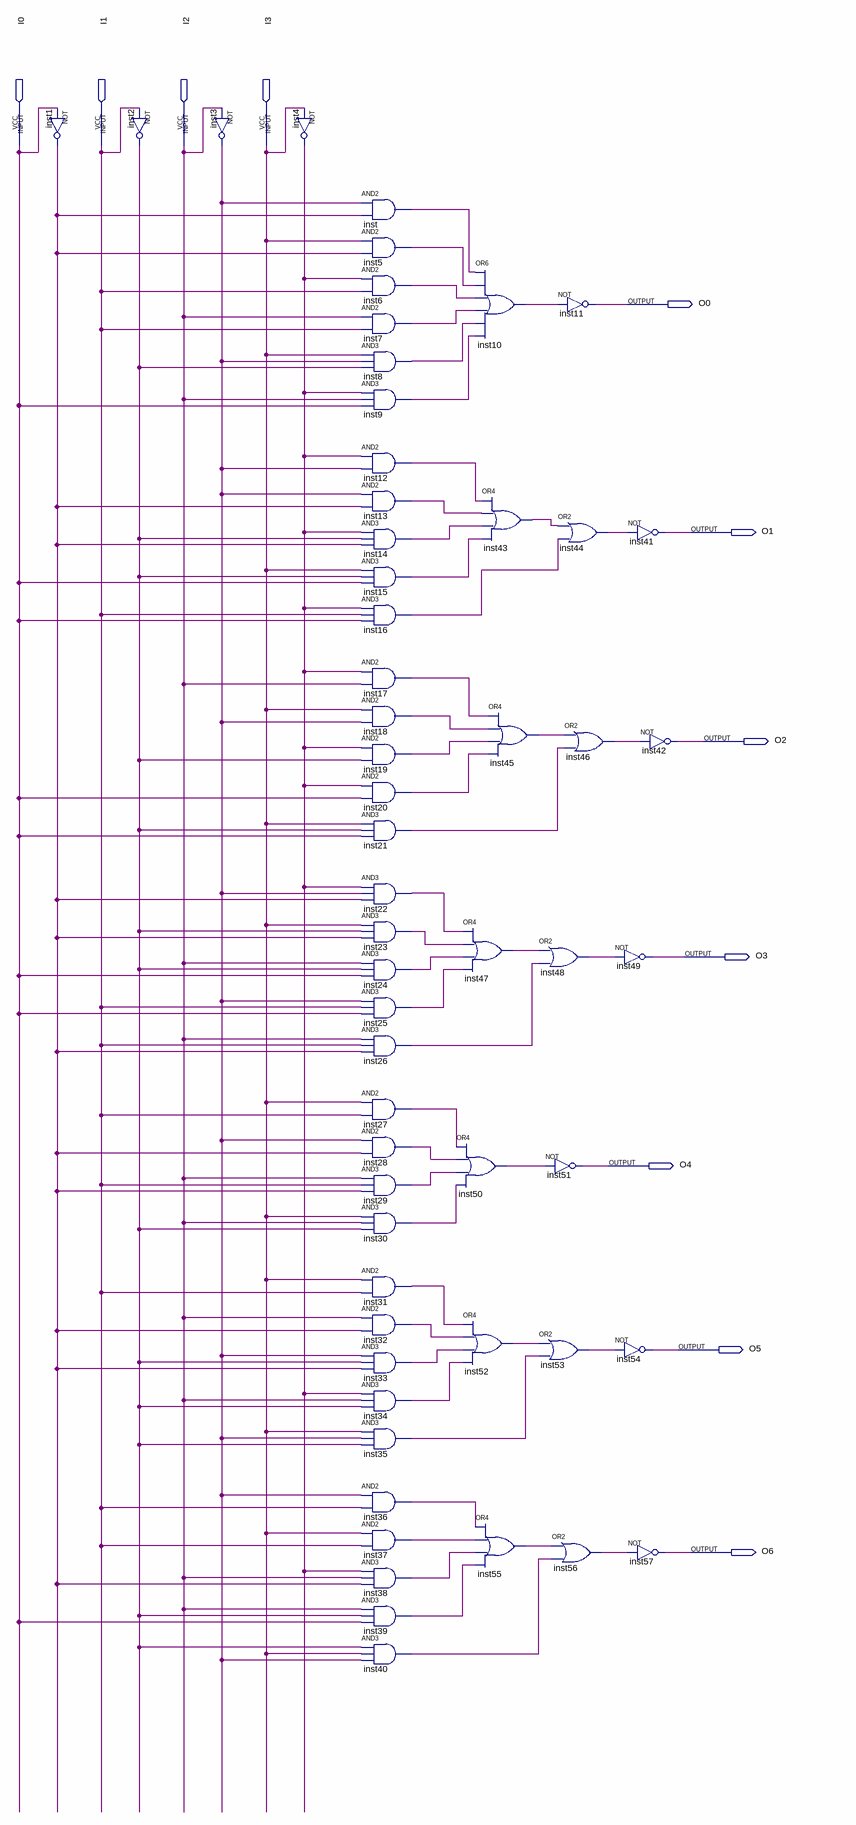
[diagram p0: schematic sheet]
// Quartus schematic lab_02.bdf as structural Verilog: 58 symbols, 11 pins
module lab_02 (
  input  I0,
  input  I1,
  input  I2,
  input  I3,
  output O0,
  output O1,
  output O2,
  output O3,
  output O4,
  output O5,
  output O6
);

  wire inst1_out, inst2_out, inst3_out, inst4_out, inst5_out, inst6_out, inst7_out, inst8_out, inst9_out,
       inst10_out, inst12_out, inst13_out, inst14_out, inst15_out, inst16_out, inst17_out, inst18_out,
       inst19_out, inst20_out, inst21_out, inst22_out, inst23_out, inst24_out, inst25_out, inst26_out,
       inst27_out, inst28_out, inst29_out, inst30_out, inst31_out, inst32_out, inst33_out, inst34_out,
       inst35_out, inst36_out, inst37_out, inst38_out, inst39_out, inst40_out, inst43_out, inst44_out,
       inst45_out, inst46_out, inst47_out, inst48_out, inst50_out, inst52_out, inst53_out, inst55_out,
       inst56_out, inst_out;

  not inst1 (inst1_out, I0);
  not inst2 (inst2_out, I1);
  not inst3 (inst3_out, I2);
  not inst4 (inst4_out, I3);
  and inst (inst_out, inst3_out, inst1_out);
  and inst5 (inst5_out, I3, inst1_out);
  and inst6 (inst6_out, inst4_out, I1);
  and inst7 (inst7_out, I2, I1);
  and inst8 (inst8_out, I3, inst3_out, inst2_out);
  and inst9 (inst9_out, inst4_out, I2, I0);
  and inst12 (inst12_out, inst4_out, inst3_out);
  and inst13 (inst13_out, inst3_out, inst1_out);
  and inst14 (inst14_out, inst4_out, inst2_out, inst1_out);
  and inst15 (inst15_out, I3, inst2_out, I0);
  and inst16 (inst16_out, inst4_out, I1, I0);
  and inst17 (inst17_out, inst4_out, I2);
  and inst18 (inst18_out, I3, inst3_out);
  and inst19 (inst19_out, inst4_out, inst2_out);
  and inst20 (inst20_out, inst4_out, I0);
  and inst21 (inst21_out, I3, inst2_out, I0);
  and inst22 (inst22_out, inst4_out, inst3_out, inst1_out);
  and inst23 (inst23_out, I3, inst2_out, inst1_out);
  and inst24 (inst24_out, I2, inst2_out, I0);
  and inst25 (inst25_out, inst3_out, I1, I0);
  and inst26 (inst26_out, I2, I1, inst1_out);
  and inst27 (inst27_out, I3, I1);
  and inst28 (inst28_out, inst3_out, inst1_out);
  and inst29 (inst29_out, I2, I1, inst1_out);
  and inst30 (inst30_out, I3, I2, inst2_out);
  and inst31 (inst31_out, I3, I1);
  and inst32 (inst32_out, I2, inst1_out);
  and inst33 (inst33_out, inst3_out, inst2_out, inst1_out);
  and inst34 (inst34_out, inst4_out, I2, inst2_out);
  and inst35 (inst35_out, I3, inst3_out, inst2_out);
  and inst36 (inst36_out, inst3_out, I1);
  and inst37 (inst37_out, I3, I1);
  and inst38 (inst38_out, inst4_out, I2, inst1_out);
  and inst39 (inst39_out, I2, inst2_out, I0);
  and inst40 (inst40_out, inst2_out, I3, inst3_out);
  or inst10 (inst10_out, inst_out, inst5_out, inst6_out, inst7_out, inst8_out, inst9_out);
  or inst43 (inst43_out, inst12_out, inst13_out, inst14_out, inst15_out);
  or inst45 (inst45_out, inst17_out, inst18_out, inst19_out, inst20_out);
  or inst47 (inst47_out, inst22_out, inst23_out, inst24_out, inst25_out);
  or inst50 (inst50_out, inst27_out, inst28_out, inst29_out, inst30_out);
  or inst52 (inst52_out, inst31_out, inst32_out, inst33_out, inst34_out);
  or inst55 (inst55_out, inst36_out, inst37_out, inst38_out, inst39_out);
  or inst48 (inst48_out, inst47_out, inst26_out);
  or inst53 (inst53_out, inst52_out, inst35_out);
  not inst11 (O0, inst10_out);
  or inst44 (inst44_out, inst43_out, inst16_out);
  or inst46 (inst46_out, inst45_out, inst21_out);
  not inst51 (O4, inst50_out);
  or inst56 (inst56_out, inst55_out, inst40_out);
  not inst41 (O1, inst44_out);
  not inst42 (O2, inst46_out);
  not inst49 (O3, inst48_out);
  not inst54 (O5, inst53_out);
  not inst57 (O6, inst56_out);
endmodule
